# Altium schematic sheet 0 Main.SchDoc
size 420 x 297 mm; SheetNumber: 1; SheetTotal: 9
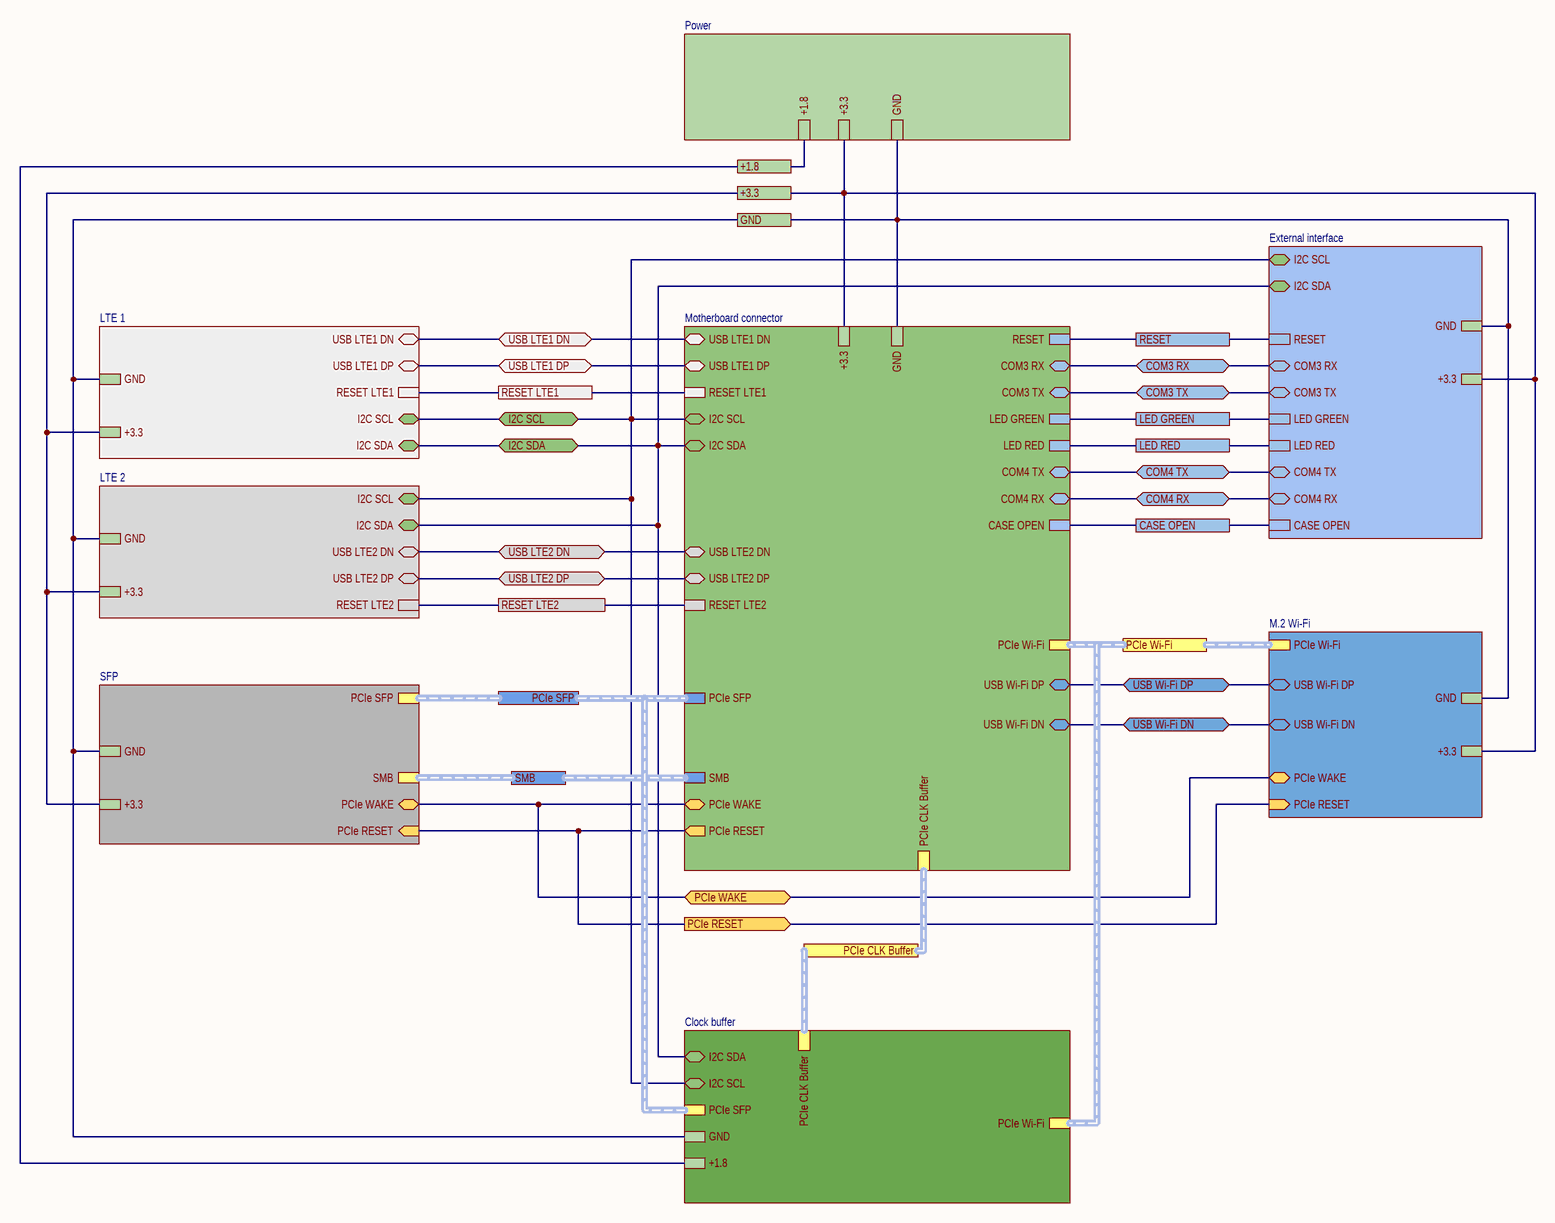
[diagram p0: 0 Main.SchDoc]

## Sub-sheets
Clock buffer = 8 Clock Buffer: PCIe SFP, PCIe Wi-Fi, PCIe CLK Buffer, +1.8, GND, I2C SCL (bidir), I2C SDA (bidir)
External interface = 5 External interface: RESET, COM3 RX (bidir), COM3 TX (bidir), LED GREEN, LED RED, COM4 TX (bidir), COM4 RX (bidir), I2C SCL (bidir), I2C SDA (bidir), +3.3, GND, CASE OPEN
LTE 1 = 2 LTE 1: I2C SCL (bidir), I2C SDA (bidir), USB LTE1 DN (bidir), USB LTE1 DP (bidir), RESET LTE1, GND, +3.3
LTE 2 = 3 LTE 2: I2C SCL (bidir), I2C SDA (bidir), USB LTE2 DN (bidir), USB LTE2 DP (bidir), RESET LTE2, +3.3, GND
M.2 Wi-Fi = 7 M.2 Wi-Fi: PCIe Wi-Fi, USB Wi-Fi DP (bidir), USB Wi-Fi DN (bidir), PCIe WAKE (bidir), PCIe RESET (in), +3.3, GND
Motherboard connector = 1 Motherboard connector: RESET, COM3 RX (bidir), COM3 TX (bidir), LED GREEN, LED RED, USB LTE1 DN (bidir), USB LTE1 DP (bidir), RESET LTE1, I2C SCL (bidir), I2C SDA (bidir), USB LTE2 DN (bidir), USB LTE2 DP (bidir), RESET LTE2, PCIe SFP, SMB, PCIe Wi-Fi, USB Wi-Fi DN (bidir), USB Wi-Fi DP (bidir), PCIe CLK Buffer, PCIe WAKE (bidir), PCIe RESET (out), COM4 TX (bidir), COM4 RX (bidir), +3.3, GND, CASE OPEN
Power = 6 Power: +3.3, GND, +1.8
SFP = 4 SFP: PCIe SFP, SMB, PCIe WAKE (bidir), PCIe RESET (in), +3.3, GND

## Ports
+1.8, +3.3, CASE OPEN, COM3 RX (bidir), COM3 TX (bidir), COM4 RX (bidir), COM4 TX (bidir), GND, I2C SCL (bidir), I2C SDA (bidir), LED GREEN, LED RED, PCIe CLK Buffer, PCIe RESET (out), PCIe SFP, PCIe WAKE (bidir), PCIe Wi-Fi (harness Wi-Fi), RESET, RESET LTE1, RESET LTE2, SMB (harness SMB), USB LTE1 DN (bidir), USB LTE1 DP (bidir), USB LTE2 DN (bidir), USB LTE2 DP (bidir), USB Wi-Fi DN (bidir), USB Wi-Fi DP (bidir)

## Nets
+1.8: port +1.8, sheet Power/+1.8, sheet Clock buffer/+1.8
+3.3: port +3.3, sheet LTE 1/+3.3, sheet Power/+3.3, sheet LTE 2/+3.3, sheet SFP/+3.3, sheet External interface/+3.3, sheet Motherboard connector/+3.3, sheet M.2 Wi-Fi/+3.3
CASE OPEN: port CASE OPEN, sheet External interface/CASE OPEN, sheet Motherboard connector/CASE OPEN
COM3 RX: port COM3 RX, sheet External interface/COM3 RX, sheet Motherboard connector/COM3 RX
COM3 TX: port COM3 TX, sheet External interface/COM3 TX, sheet Motherboard connector/COM3 TX
COM4 RX: port COM4 RX, sheet External interface/COM4 RX, sheet Motherboard connector/COM4 RX
COM4 TX: port COM4 TX, sheet External interface/COM4 TX, sheet Motherboard connector/COM4 TX
GND: port GND, sheet LTE 1/GND, sheet Power/GND, sheet LTE 2/GND, sheet SFP/GND, sheet External interface/GND, sheet Motherboard connector/GND, sheet M.2 Wi-Fi/GND, sheet Clock buffer/GND
I2C SCL: port I2C SCL, sheet LTE 1/I2C SCL, sheet LTE 2/I2C SCL, sheet External interface/I2C SCL, sheet Motherboard connector/I2C SCL, sheet Clock buffer/I2C SCL
I2C SDA: port I2C SDA, sheet LTE 1/I2C SDA, sheet LTE 2/I2C SDA, sheet External interface/I2C SDA, sheet Motherboard connector/I2C SDA, sheet Clock buffer/I2C SDA
LED GREEN: port LED GREEN, sheet External interface/LED GREEN, sheet Motherboard connector/LED GREEN
LED RED: port LED RED, sheet External interface/LED RED, sheet Motherboard connector/LED RED
PCIe RESET: port PCIe RESET, sheet SFP/PCIe RESET, sheet Motherboard connector/PCIe RESET, sheet M.2 Wi-Fi/PCIe RESET
PCIe WAKE: port PCIe WAKE, sheet SFP/PCIe WAKE, sheet Motherboard connector/PCIe WAKE, sheet M.2 Wi-Fi/PCIe WAKE
RESET: port RESET, sheet External interface/RESET, sheet Motherboard connector/RESET
RESET LTE1: port RESET LTE1, sheet LTE 1/RESET LTE1, sheet Motherboard connector/RESET LTE1
RESET LTE2: port RESET LTE2, sheet LTE 2/RESET LTE2, sheet Motherboard connector/RESET LTE2
USB LTE1 DN: port USB LTE1 DN, sheet LTE 1/USB LTE1 DN, sheet Motherboard connector/USB LTE1 DN
USB LTE1 DP: port USB LTE1 DP, sheet LTE 1/USB LTE1 DP, sheet Motherboard connector/USB LTE1 DP
USB LTE2 DN: port USB LTE2 DN, sheet LTE 2/USB LTE2 DN, sheet Motherboard connector/USB LTE2 DN
USB LTE2 DP: port USB LTE2 DP, sheet LTE 2/USB LTE2 DP, sheet Motherboard connector/USB LTE2 DP
USB Wi-Fi DN: port USB Wi-Fi DN, sheet Motherboard connector/USB Wi-Fi DN, sheet M.2 Wi-Fi/USB Wi-Fi DN
USB Wi-Fi DP: port USB Wi-Fi DP, sheet Motherboard connector/USB Wi-Fi DP, sheet M.2 Wi-Fi/USB Wi-Fi DP

## Buses and harness runs
harness port PCIe CLK Buffer = sheet Clock buffer/PCIe CLK Buffer = sheet Motherboard connector/PCIe CLK Buffer
harness port PCIe SFP = sheet Clock buffer/PCIe SFP = sheet Motherboard connector/PCIe SFP = sheet SFP/PCIe SFP
harness port PCIe Wi-Fi = sheet Clock buffer/PCIe Wi-Fi = sheet M.2 Wi-Fi/PCIe Wi-Fi = sheet Motherboard connector/PCIe Wi-Fi
harness port SMB = sheet Motherboard connector/SMB = sheet SFP/SMB

## Notes on the sheet
- Перв. примен.
- Справ. №
- Подп. и дата
- Инв. № дубл.
- Взам. инв. №
- Разраб.
- Изм.
- Лист
- № докум.
- Подп.
- Дата
- Лит.
- Масса
- Масштаб
- Пров.
- Т.контр.
- Листов
- Инв. № подл.
- Утв.
- Н.контр.
- 2.106-A3
- Копировал
- Формат А3